# EAGLE schematic ArduSensor-Fart (EAGLE 6.0)
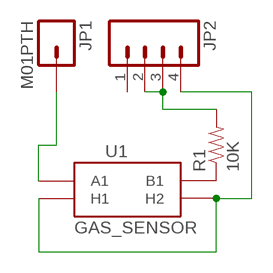
[diagram p0: schematic, sheet 1]

## Parts
JP1  M01PTH  [1X01]
JP2  M04PTH  [1X04]
R1  10K  RESISTORAXIAL-0.3  [AXIAL-0.3]
U1  GAS_SENSOR  [MQ-3]

## Nets
N$1: JP2.2 JP2.3 R1.P$2
N$2: R1.P$1 U1.B1
N$3: JP1.1 U1.A1
N$4: JP2.4 U1.HA(H1) U1.HB(H2)
Unconnected: JP2.1

## Library data of the parts
JP1 = SFE Connectors:M01: Header 1 Standard 1-pin 0.1" header. Use with straight break away headers (SKU : PRT-00116), right angle break away headers (PRT-00553), swiss pins (PRT-00743), machine pins (PRT-00117), and female headers (PRT-00115).
JP2 = SFE Connectors:M04: Header 4 Standard 4-pin 0.1" header. Use with straight break away headers (SKU : PRT-00116), right angle break away headers (PRT-00553), swiss pins (PRT-00743), machine pins (PRT-00117), and female headers (PRT-00115). Molex polarized connector foot print use with SKU : PRT-08231 with associated crimp pins and housings. 1MM SMD Version SKU: PRT-10208
R1 = SFE Passives:RESISTOR: Resistor Basic schematic elements and footprints for 0603, 1206, and PTH resistors.
U1 = SFE Sensors:GAS_SENSOR: MQ-3 alcohol gas sensor . FP not tested. SEN-08880.